# Altium project I2CKeypad.PrjPcb
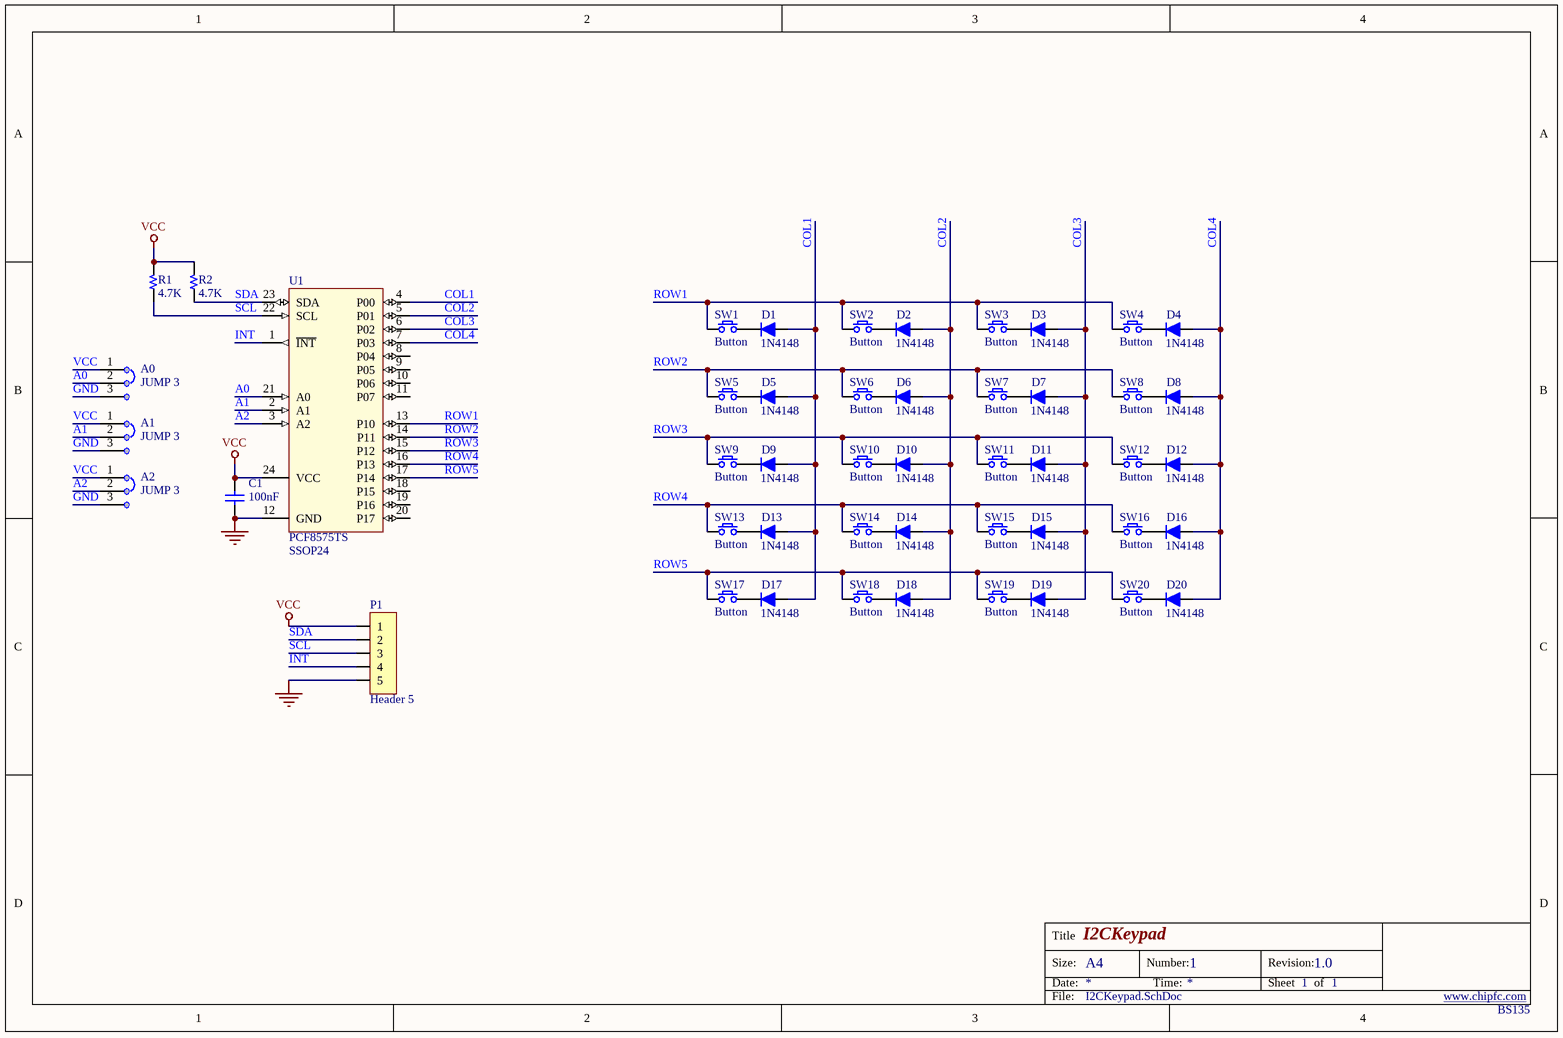
[diagram p0: I2CKeypad.SchDoc]
1 sheet, 48 parts. Net scope: global (net labels, ports and power ports of the same name join across sheets).
Board file: I2CKeypad.PcbDoc

## Sheet I2CKeypad.SchDoc: I2CKeypad
size A4; DocumentNumber: 1; Revision: 1.0; SheetNumber: 1; SheetTotal: 1

### Parts
A0  JUMP 3  [JUMP3 SMD]
A1  JUMP 3  [JUMP3 SMD]
A2  JUMP 3  [JUMP3 SMD]
C1  100nF  [C 0805]
D1  1N4148  [Diode SOD80C Wave]
D2  1N4148  [Diode SOD80C Wave]
D3  1N4148  [Diode SOD80C Wave]
D4  1N4148  [Diode SOD80C Wave]
D5  1N4148  [Diode SOD80C Wave]
D6  1N4148  [Diode SOD80C Wave]
D7  1N4148  [Diode SOD80C Wave]
D8  1N4148  [Diode SOD80C Wave]
D9  1N4148  [Diode SOD80C Wave]
D10  1N4148  [Diode SOD80C Wave]
D11  1N4148  [Diode SOD80C Wave]
D12  1N4148  [Diode SOD80C Wave]
D13  1N4148  [Diode SOD80C Wave]
D14  1N4148  [Diode SOD80C Wave]
D15  1N4148  [Diode SOD80C Wave]
D16  1N4148  [Diode SOD80C Wave]
D17  1N4148  [Diode SOD80C Wave]
D18  1N4148  [Diode SOD80C Wave]
D19  1N4148  [Diode SOD80C Wave]
D20  1N4148  [Diode SOD80C Wave]
P1  Header 5  [Header 5]
R1  4.7K  [R 0805]
R2  4.7K  [R 0805]
SW1  Button  [SW/2/DIP]
SW2  Button  [SW/2/DIP]
SW3  Button  [SW/2/DIP]
SW4  Button  [SW/2/DIP]
SW5  Button  [SW/2/DIP]
SW6  Button  [SW/2/DIP]
SW7  Button  [SW/2/DIP]
SW8  Button  [SW/2/DIP]
SW9  Button  [SW/2/DIP]
SW10  Button  [SW/2/DIP]
SW11  Button  [SW/2/DIP]
SW12  Button  [SW/2/DIP]
SW13  Button  [SW/2/DIP]
SW14  Button  [SW/2/DIP]
SW15  Button  [SW/2/DIP]
SW16  Button  [SW/2/DIP]
SW17  Button  [SW/2/DIP]
SW18  Button  [SW/2/DIP]
SW19  Button  [SW/2/DIP]
SW20  Button  [SW/2/DIP]
U1  PCF8575TS  PACKAGE: SSOP24  [SSOP24/PCF8575TS]

### Nets
GND: A0.3 A1.3 A2.3 C1.2 P1.5 U1.12(GND)
VCC: A0.1 A1.1 A2.1 C1.1 P1.1 R1.2 R2.2 U1.24(VCC)
A0: A0.2 U1.21(A0)
A1: A1.2 U1.2(A1)
A2: A2.2 U1.3(A2)
COL1: D1.1(A) D5.1(A) D9.1(A) D13.1(A) D17.1(A) U1.4(P00)
COL2: D2.1(A) D6.1(A) D10.1(A) D14.1(A) D18.1(A) U1.5(P01)
COL3: D3.1(A) D7.1(A) D11.1(A) D15.1(A) D19.1(A) U1.6(P02)
COL4: D4.1(A) D8.1(A) D12.1(A) D16.1(A) D20.1(A) U1.7(P03)
INT: P1.4 U1.1(~{INT})
ROW1: SW1.1 SW2.1 SW3.1 SW4.1 U1.13(P10)
ROW2: SW5.1 SW6.1 SW7.1 SW8.1 U1.14(P11)
ROW3: SW9.1 SW10.1 SW11.1 SW12.1 U1.15(P12)
ROW4: SW13.1 SW14.1 SW15.1 SW16.1 U1.16(P13)
ROW5: SW17.1 SW18.1 SW19.1 SW20.1 U1.17(P14)
SCL: P1.3 R1.1 U1.22(SCL)
SDA: P1.2 R2.1 U1.23(SDA)
NetD1_2: D1.2(K) SW1.2
NetD2_2: D2.2(K) SW2.2
NetD3_2: D3.2(K) SW3.2
NetD4_2: D4.2(K) SW4.2
NetD5_2: D5.2(K) SW5.2
NetD6_2: D6.2(K) SW6.2
NetD7_2: D7.2(K) SW7.2
NetD8_2: D8.2(K) SW8.2
NetD9_2: D9.2(K) SW9.2
NetD10_2: D10.2(K) SW10.2
NetD11_2: D11.2(K) SW11.2
NetD12_2: D12.2(K) SW12.2
NetD13_2: D13.2(K) SW13.2
NetD14_2: D14.2(K) SW14.2
NetD15_2: D15.2(K) SW15.2
NetD16_2: D16.2(K) SW16.2
NetD17_2: D17.2(K) SW17.2
NetD18_2: D18.2(K) SW18.2
NetD19_2: D19.2(K) SW19.2
NetD20_2: D20.2(K) SW20.2

Not connected (* = marked no-connect by the designer): U1 8(P04) 9(P05) 10(P06) 11(P07) 18(P15) 19(P16) 20(P17)

### Notes on the sheet
- www.chipfc.com
- BS135
- Title
- Size:
- Date:
- A4
- Number:
- Time:
- Revision:
- Sheet
- of
- File:

### Library data of the parts
C1 = Capacitor NP: Capacitor non-pol
D1-D20 = Diode: Default Diode
P1 = Header 5: Header, 5-Pin
R1 R2 = Resistor
SW1-SW20 = SW SPST: Tact switch 2 pin
U1 = PCF8575TS: PCF8575 Remote16-BIT I  2C AND SMBus I/O Expander  with Interrupt Output; BRAND: NXP; PART NO: PCF8575TS; TYPE: SMD